# Altium schematic sheet ADC-Buzzer.SchDoc
size A4; SheetNumber: 14; SheetTotal: 14
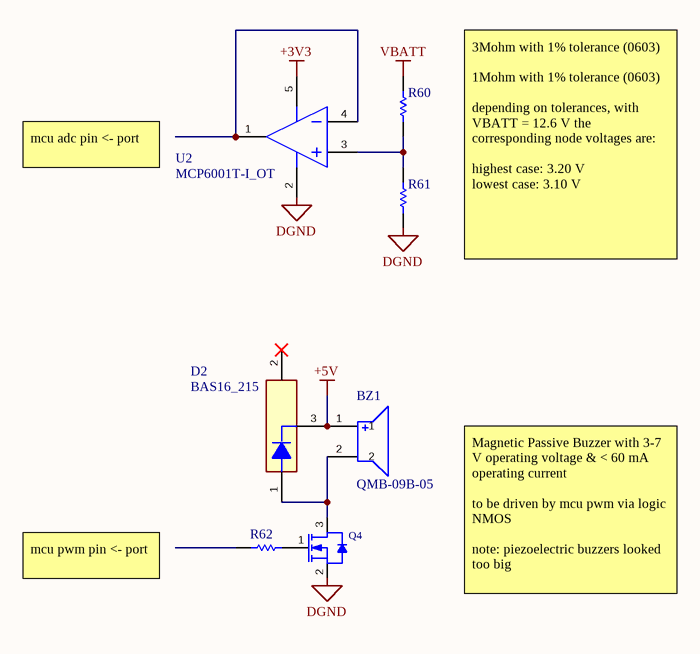
[diagram p0: ADC-Buzzer.SchDoc]

## Parts
BZ1  QMB-09B-05  [QMB-09B-05]
D2  BAS16_215  [BAS16_215]
Q4  IRLML6344TRPBF-ES  [IRLML6344TRPBF-ES]  (value not drawn)
R60  FRC0603F3004TS  [FRC0603F3004TS]  (value not drawn)
R61  RC0603FR-071ML  [RC0603FR-071ML]  (value not drawn)
R62  RC0603FR-0710RL  [RC0603FR-071ML]  (value not drawn)
U2  MCP6001T-I_OT  [MCP6001T-I_OT]

## Nets
+3V3: U2.5(VDD)
+5V: BZ1.1 D2.3
DGND: Q4.2(S) R61.1 U2.2(VSS)
VBATT: R60.2
NetBZ1_2: BZ1.2 D2.1 Q4.3(D)
NetQ4_1: Q4.1(G) R62.2
NetR60_1: R60.1 R61.2 U2.3(VIN+)
NetU2_1: U2.1(VOUT) U2.4(VIN-)

Not connected (* = marked no-connect by the designer): D2 2*; R62 1

## Notes on the sheet
- mcu adc pin <- port
- 3Mohm with 1% tolerance (0603)
  1Mohm with 1% tolerance (0603)
  depending on tolerances, with VBATT = 12.6 V the corresponding node voltages are:
  highest case: 3.20 V
  lowest case: 3.10 V
- mcu pwm pin <- port
- Magnetic Passive Buzzer with 3-7 V operating voltage & < 60 mA operating current
  to be driven by mcu pwm via logic NMOS
  note: piezoelectric buzzers looked too big

## Library data of the parts
BZ1 = QMB-09B-05: -40℃~+85℃ 2.7kHz 3V~7V 5.7mm 5V 60mA 80dB 9mm Electromagnetic Passive (Externally Driven) 插件,D=9mm Buzzers ROHS; LCSC Part #: C161819; Manu Part #: QMB-09B-05
D2 = BAS16_215: 1.25V@150mA 100V 215mA 250mW 4A 4ns 500nA@80V Independent SOT-23 Switching Diodes ROHS; Manu Part #: BAS16,215; LCSC Part #: C79997
Q4 = IRLML6344TRPBF-ES: 1 N-channel 1.4W 1.6V 170pF 25pF 30V 34mΩ@10V、50mΩ@4.5V 35pF 4.1nC@10V 4.3A N-Channel SOT-23 MOSFETs ROHS; LCSC Part #: C21713845; Manu Part #: IRLML6344TRPBF-ES
R60 = FRC0603F3004TS: -55℃~+155℃ 100mW 3MΩ 75V Thick Film Resistor ±1% ±100ppm/℃ 0603 Chip Resistor - Surface Mount ROHS; LCSC Part #: C2930149; Manu Part #: FRC0603F3004TS
R61 = RC0603FR-071ML: -55℃~+155℃ 100mW 1MΩ 75V Thick Film Resistor ±1% ±100ppm/℃ 0603 Chip Resistor - Surface Mount ROHS; LCSC Part #: C105578; Manu Part #: RC0603FR-071ML
R62 = RC0603FR-0710RL: -55℃~+155℃ 100mW 10Ω 75V Thick Film Resistor ±1% ±200ppm/℃ 0603 Chip Resistor - Surface Mount ROHS; LCSC Part #: C109318; Manu Part #: RC0603FR-0710RL
U2 = MCP6001T-I_OT: -40℃~+85℃ 1 1.8V~6V 100uA 1MHz 1pA 1pA 23mA 28nV/√Hz@1kHz 2uV/℃ 4.5mV 600V/ms 6V 76dB Rail-to-Rail Input, Rail-to-Rail Output SOT-23-5 Operational Amplifier ROHS; Manu Part #: MCP6001T-I/OT; LCSC Part #: C116490